# Altium schematic sheet Sheet1.SchDoc
size A4
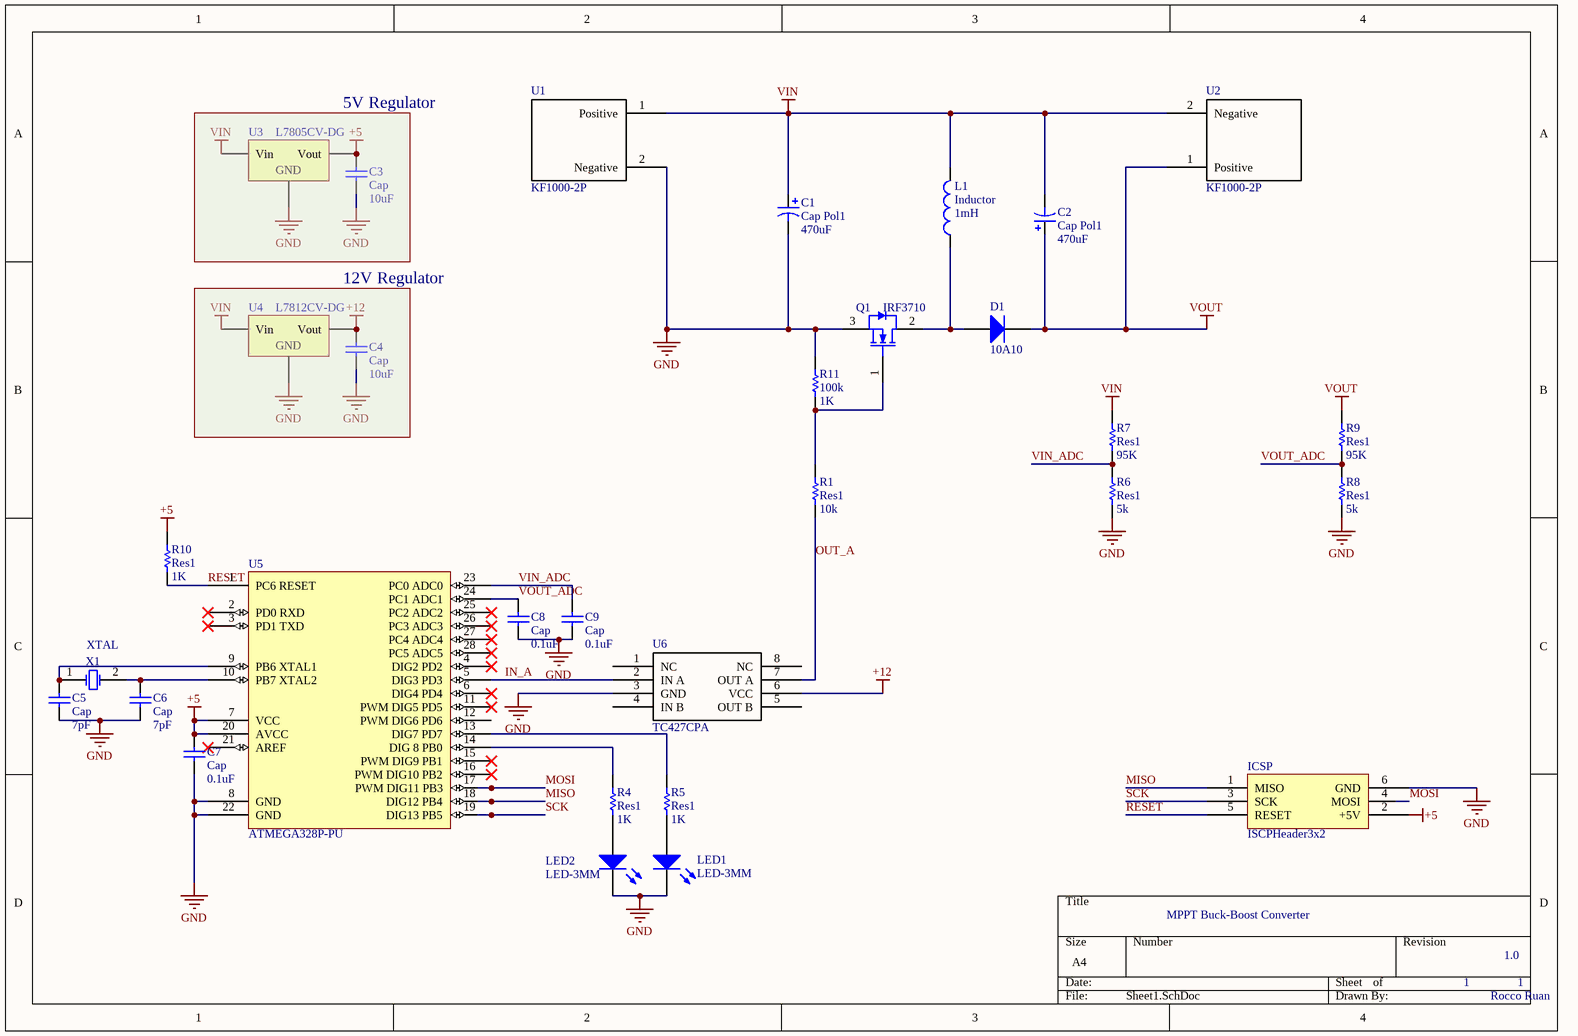
[diagram p0: Sheet1.SchDoc]

## Parts
C1  Cap Pol1  value 470uF  [RB7.6-15]
C2  Cap Pol1  value 470uF  [RB7.6-15]
C3  Cap  value 10uF  [Ceramic Capacitor]
C4  Cap  value 10uF  [Ceramic Capacitor]
C5  Cap  value 7pF  [Ceramic Capacitor]
C6  Cap  value 7pF  [Ceramic Capacitor]
C7  Cap  value 0.1uF  [Ceramic Capacitor]
C8  Cap  value 0.1uF  [Ceramic Capacitor]
C9  Cap  value 0.1uF  [Ceramic Capacitor]
D1  10A10  [Diode]
ICSP  ISCPHeader3x2  [3x2 Header]
L1  Inductor  value 1mH  [Toroidal Inductor]
LED1  LED-3MM  [LED-1]
LED2  LED-3MM  [LED-1]
Q1  IRF3710  [NXP-SOT226]
R1  Res1  value 10k  [6-0805_M]
R4  Res1  value 1K  [6-0805_M]
R5  Res1  value 1K  [6-0805_M]
R6  Res1  value 5k  [6-0805_M]
R7  Res1  value 95K  [6-0805_M]
R8  Res1  value 5k  [6-0805_M]
R9  Res1  value 95K  [6-0805_M]
R10  Res1  value 1K  [6-0805_M]
R11  100k  value 1K  [6-0805_M]
U1  KF1000-2P  [2x1 HEADER]
U2  KF1000-2P  [2x1 HEADER]
U3  L7805CV-DG  [TO-220AB]
U4  L7812CV-DG  [TO-220AB]
U5  ATMEGA328P-PU  [*DIP254P762X457-28]
U6  TC427CPA  [*DIP787W46P254L927H533Q8]
X1  XTAL  [Oscillator]

## Blocks framed on the sheet
5V Regulator: C3 U3
12V Regulator: C4 U4

## Nets
+5: C3.2 C7.2 ICSP.2(+5V) R10.2 U3.3(Vout) U5.7(VCC) U5.20(AVCC)
+12: C4.2 U4.3(Vout) U6.6(VCC)
GND: C1.2 C3.1 C4.1 C5.1 C6.1 C7.1 C8.1 C9.1 ICSP.6(GND) LED1.2(K) LED2.2(K) Q1.3(S) R6.1 R8.1 R11.2 U1.2(Negative) U3.2(GND) U4.2(GND) U5.8(GND) U5.22(GND) U6.3(GND)
VIN: C1.1 C2.2 L1.2 R7.2 U1.1(Positive) U2.2(Negative) U3.1(Vin) U4.1(Vin)
VOUT: C2.1 D1.2(K) R9.2 U2.1(Positive)
IN_A: U5.5(DIG3_PD3) U6.2(IN_A)
MISO: ICSP.1(MISO) U5.18(DIG12_PB4)
MOSI: ICSP.4(MOSI) U5.17(PWM_DIG11_PB3)
OUT_A: R1.1 U6.7(OUT_A)
RESET: ICSP.5(RESET) R10.1 U5.1(PC6_RESET)
SCK: ICSP.3(SCK) U5.19(DIG13_PB5)
VIN_ADC: C9.2 R6.2 R7.1 U5.23(PC0_ADC0)
VOUT_ADC: C8.2 R8.2 R9.1 U5.24(PC1_ADC1)
NetC5_2: C5.2 U5.9(PB6_XTAL1) X1.1(OSC1)
NetC6_2: C6.2 U5.10(PB7_XTAL2) X1.2(OSC2)
NetD1_1: D1.1(A) L1.1 Q1.2(D)
NetLED1_1: LED1.1(A) R5.1
NetLED2_1: LED2.1(A) R4.1
NetQ1_1: Q1.1(G) R1.2 R11.1
NetR4_2: R4.2 U5.14(DIG_8_PB0)
NetR5_2: R5.2 U5.13(DIG7_PD7)

Not connected (* = marked no-connect by the designer): U5 2(PD0_RXD)* 3(PD1_TXD)* 4(DIG2_PD2)* 6(DIG4_PD4)* 11(PWM_DIG5_PD5)* 12(PWM_DIG6_PD6) 15(PWM_DIG9_PB1)* 16(PWM_DIG10_PB2)* 21(AREF)* 25(PC2_ADC2)* 26(PC3_ADC3)* 27(PC4_ADC4)* 28(PC5_ADC5)*; U6 1(NC) 4(IN_B) 5(OUT_B) 8(NC)

## Notes on the sheet
- MPPT Buck-Boost Converter
- 1
- 1.0
- Rocco Ruan

## Library data of the parts
C1 C2 = Cap Pol1: Polarized Capacitor (Radial); Published: 8-Jun-2000; LatestRevisionDate: 17-Jul-2002; LatestRevisionNote: Re-released for DXP Platform.; PackageReference: RB7.6-15; Publisher: Altium Limited; PackageDescription: Polarized Capacitor (Radial); 2 Leads
C3-C9 = Cap: Capacitor; Published: 8-Jun-2000; LatestRevisionDate: 17-Jul-2002; LatestRevisionNote: Re-released for DXP Platform.; PackageReference: RAD-0.3; Publisher: Altium Limited; PackageDescription: Radial Cap, Thru-Hole; 2 Leads; 0.3 in Pin Spacing
D1 = Diode: Default Diode; Published: 8-Jun-2000; LatestRevisionDate: 17-Jul-2002; LatestRevisionNote: Re-released for DXP Platform.; PackageVersion: Sep-1996; PackageReference: SMC; Publisher: Altium Limited; PackageDescription: DO-214-AB/SMC; 2 C-Bend Leads; Body 7.9 x 5.9 mm, inc. leads (LxW); Code_JEDEC: DO-214-AB
L1 = Inductor: Code_IEC: 1005; Published: 8-Jun-2000; LatestRevisionDate: 29-May-2009; LatestRevisionNote: IPC-7351 Footprint Added.; PackageReference: 0402-A; Publisher: Altium Limited; PackageDescription: Chip Inductor; Code_JEITA: 0402
LED1 LED2 = LED1: Typical RED GaAs LED; Published: 8-Jun-2000; LatestRevisionDate: 08-Jul-2005; LatestRevisionNote: Mech Layer 1 removed.; PackageReference: LED-1; Publisher: Altium Limited; PackageDescription: LED; 2 Leads
Q1 = CMP-1259-00071-1: N-Channel TrenchMOS Logic Level FET, 40 V, 3-Pin SOT226, Rail; Manufacturer: NXP Semiconductors; PartNumber: BUK9E4R4-40B,127; Qr [typ] (nC): 67; VGSth [typ] (V): 1.5; VDS [max] (V): 40; Automotive Qualified: Y; IDM [max] (A): 697; Channel Type: N; PackageVersion: 09-08-25, 08/2009; ComponentLink1URL: http://www.nxp.com/; ComponentLink3URL: http://www.nxp.com/documents/outline_drawing/sot226_po.pdf; PackageReference: SOT226; Mounting Technology: Through Hole; ComponentLink2Description: Datasheet; DatasheetVersion: Rev. 03; ComponentLink3Description: Package Specification; ComponentLink1Description: Manufacturer URL; ComponentLink2URL: http://www.nxp.com/documents/data_sheet/BUK9E4R4-40B.pdf; Code_JEDEC: TO-262; PackageDescription: 3-Pin Flange Mount, Vertical Straight Lead, Body 10 x 4.3 mm, Pitch 2.54 mm; Packing: Rail
R1 R4-R11 = Res1: Resistor; Published: 8-Jun-2000; LatestRevisionDate: 17-Jul-2002; LatestRevisionNote: Re-released for DXP Platform.; PackageReference: AXIAL-0.3; Publisher: Altium Limited; PackageDescription: Axial Device, Thru-Hole; 2 Leads; 0.3 in Pin Spacing
U1 U2 = Screw_Terminal
U3 U4 = Volt Reg: Voltage Regulator; Published: 24-Mar-1999; LatestRevisionDate: 29-May-2009; LatestRevisionNote: IPC-7351 Footprint Added.; PackageReference: D2PAK; Publisher: Altium Limited; PackageDescription: 3-Pin Transistor Outline Package 2.54 mm Pitch, 15.1 mm Lead Span
U5 = ATMEGA
X1 = XTAL: Crystal Oscillator; Published: 8-Jun-2000; LatestRevisionDate: 17-Jul-2002; LatestRevisionNote: Re-released for DXP Platform.; PackageReference: R38; Publisher: Altium Limited; PackageDescription: Crystal, Thru-Hole; 2 Leads; Body 3.1 x 8.2 mm (Dia.xH)